# EAGLE design schema (EAGLE 8.7.0)
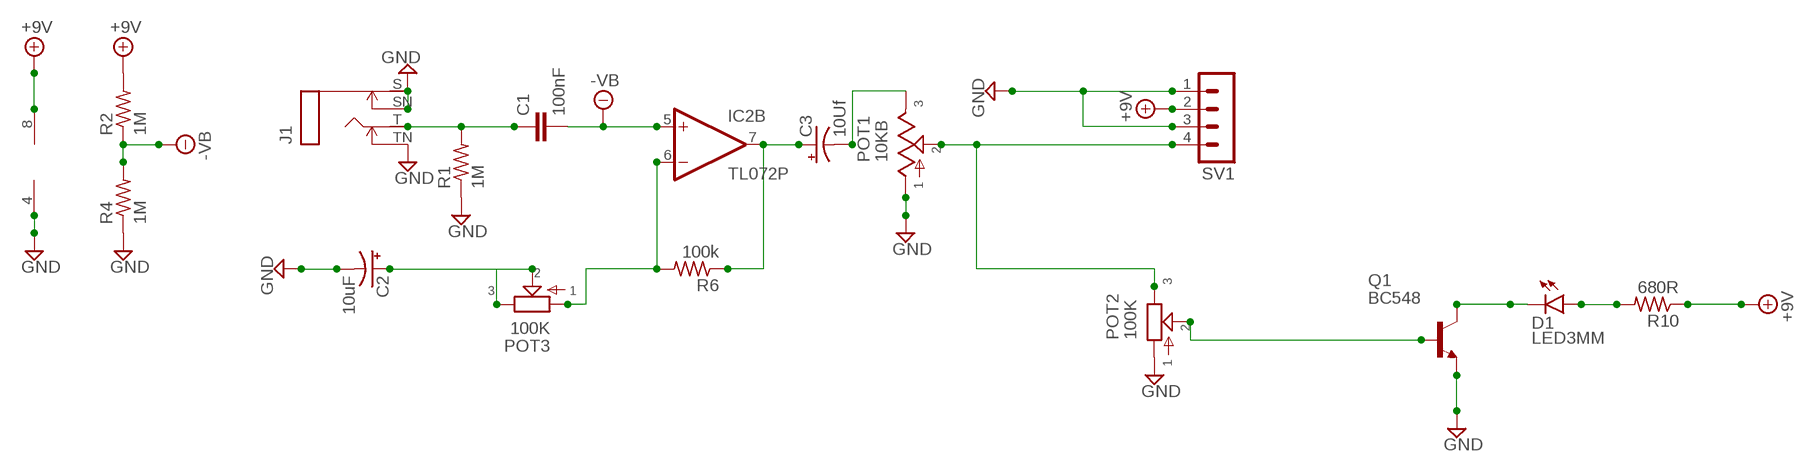
[diagram p0: schematic, sheet 1]

## Parts
C1  100nF  072X0352  [072X035]
C2  10uF  0501  [050_020_1]
C3  10Uf  0501  [050_020_1]
D1  LED3MM  [LED3MM]
IC2  TL072P  [DIL08]
J1  MONOSWS  [NMJ4HC-S]
POT1  10KB  POTPCB  [16MM-PCB-MOUNT]
POT2  100K  POT-EU25  [B25P]
POT3  100K  POT-EU25  [B25P]
Q1  BC548  [TO92-EBC]
R1  1M  6MM.3  [R0207/3]
R2  1M  6MM.3  [R0207/3]
R4  1M  6MM.3  [R0207/3]
R6  100k  6MM.1  [R0207/1V]
R10  680R  6MM.3  [R0207/3]
SV1  MA04-1  [MA04-1]

## Nets
+9V: IC2.8(P:V+) R2.2 R10.1 SV1.2
-VB: C1.2 IC2.5(B:+IN) R2.1 R4.2
GND: C2.- IC2.4(P:V-) J1.S J1.SN J1.TN POT1.1 POT2.1 Q1.E R1.1 R4.1 SV1.1 SV1.3
N$1: C1.1 J1.T R1.2
N$2: IC2.6(B:-IN) POT3.1 R6.2
N$3: C3.- POT1.3
N$4: D1.A R10.2
N$6: C2.+ POT3.2 POT3.3
N$7: D1.K(C) Q1.C
N$8: C3.+ IC2.7(B:OUT) R6.1
N$9: POT1.2 POT2.3 SV1.4
N$10: POT2.2 Q1.B
Unconnected: IC2.1(A:OUT) IC2.2(A:-IN) IC2.3(A:+IN)

## Library data of the parts
C1 = mb_caps-box:072X035: 0.15 - 1.0uF; WIMA MKP2 63, 100V: 0.047uF; MKS2 50V: 0.68 - 1.0uF; 63V: 0.33 - 0.47uF; 100V: 0.15 - 0.22uF;
C2 C3 = mb_caps-electro:050: 0.22 - 100uF Xicon values at Mouser.com: 10V: 10 - 100uF; 16V: 2.2 - 47uF; 25V: 0.47 - 47uF; 50V: 0.22 - 22uF
D1 = mb_diodes:LED
IC2 = mb_ics:TL072: OP AMP
J1 = mb_jacks:MONOSW
POT1 = mb_pots:POT: Potentiometers the arrow indicates the clockwise motion of th wiper (lug 2) fully counter clockwise there is no resistance between lugs 1 and 2 fully clockwise the resistance between lugs 1 and 2 is the value of the pot
POT2 POT3 = mb_pots:POT-EU
Q1 = transistor-npn:BC548*: NPN Transistor
R1 R2 R4 R6 R10 = mb_resistors:6MM: 6mm Resistors Leads spaced 1-6 holes apart for 0.1" perfboard. Suitable for 1/4 watt resistors.
SV1 = con-lstb:MA04-1: PIN HEADER; OC_FARNELL: unknown; OC_NEWARK: unknown

## Board
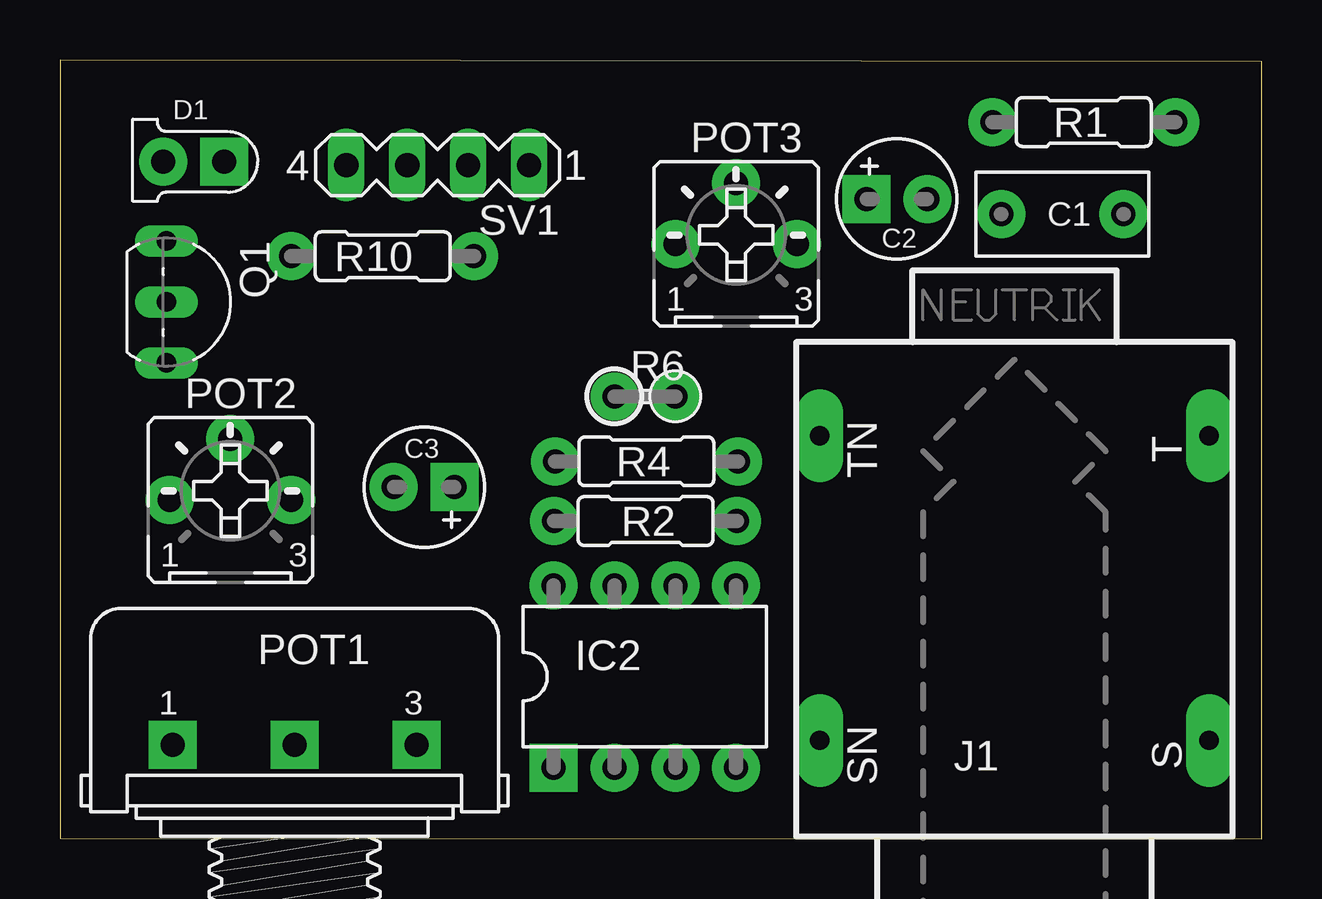
[diagram p1: board, top side]
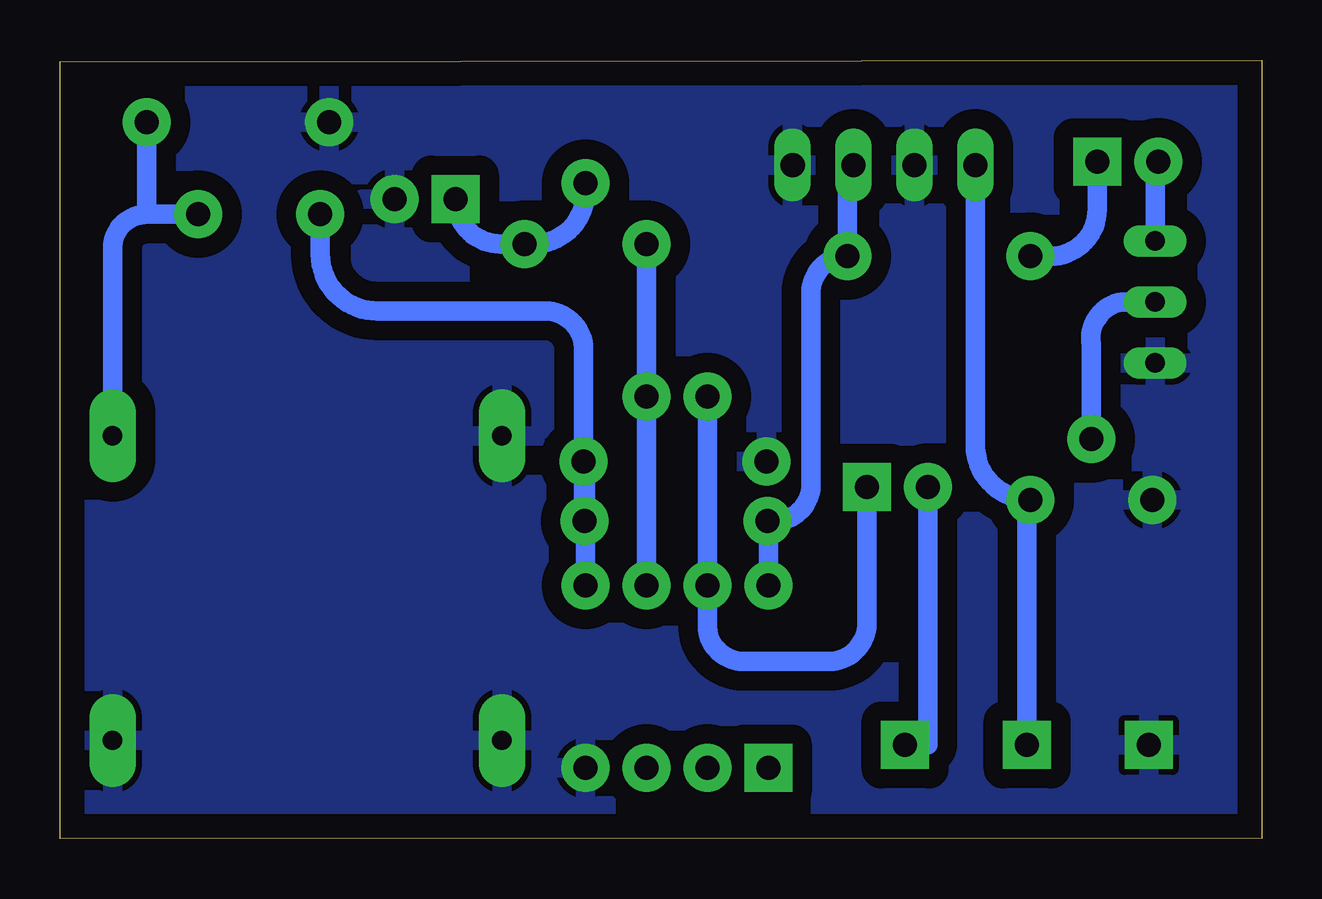
[diagram p2: board, bottom side, seen from below]

Size 50.09 x 32.46 mm. Coordinates in mm from the lower left corner, seen from the top.
Outline: 0,0.02 50.09,0 50.08,32.38 0,32.46 0,0.02
Copper layers (1*16): Top 0.035mm / dielectric 1.5mm / Bottom 0.035mm
Design rules "default": minimum track width 10mil, minimum drill 24mil, track to track 8mil, track to pad 8mil, pad to pad 8mil, via to via 8mil, smd to smd 8mil, copper to edge 40mil, drill to drill 8mil, minimum pad ring 10mil, minimum via ring 8mil, stop-mask expansion 4mil, vias tented up to drill 0mil, thermal gap 10mil

### Footprints (pad centres in the part's own frame; a part is rotated, then mirrored left to right if it is on the bottom)
072X035 = drill 1 pad 2: 1 -2.54,0; 2 2.54,0
050_020_1 = drill 1 pad 2 square: + -1.27,0 | drill 1 pad 2: - 1.27,0
LED3MM = drill 1 pad 2 square: A -1.27,0 | drill 1 pad 2: K 1.27,0
DIL08 = drill 1 pad 2 square: 1 -3.81,-3.81 | drill 1 pad 2: 2 -1.27,-3.81; 3 1.27,-3.81; 4 3.81,-3.81; 5 3.81,3.81; 6 1.27,3.81; 7 -1.27,3.81; 8 -3.81,3.81
NMJ4HC-S = drill 0.8 pad 1.93 long: S 5.08,8.115; SN 5.08,-8.115; T -7.62,8.115; TN -7.62,-8.115
16MM-PCB-MOUNT = drill 1 pad 2 square: 1 5.08,0; 2 0,0; 3 -5.08,0
B25P = drill 1 pad 2: 1 -2.54,0; 2 0,2.54; 3 2.54,0
TO92-EBC = drill 0.813 long: B 0,-1.27; C -2.54,-1.27; E 2.54,-1.27
R0207/3 = drill 1 pad 2: 1 -3.81,0; 2 3.81,0
R0207/1V = drill 1 pad 2: 1 -1.27,0; 2 1.27,0
MA04-1 = drill 1.016 long: 1 -3.81,0; 2 -1.27,0; 3 1.27,0; 4 3.81,0

### Placement (x,y rotation side)
C1  41.78,26.03 180 top
C2  34.88,26.67 0 top
C3  15.19,14.65 180 top
D1  5.58,28.22 180 top
IC2  24.38,6.75 0 top
J1  39.78,9.17 270 top
POT1  9.78,3.91 180 top
POT2  7.1,14.12 0 top
POT3  28.19,24.79 0 top
Q1  5.71,22.38 270 top
R1  42.67,29.87 0 top
R2  24.41,13.24 180 top
R4  24.44,15.73 0 top
R6  24.38,18.44 0 top
R10  13.45,24.28 180 top
SV1  15.74,28.08 180 top

### Tracks (layer width: path | path; a pad name or v marks a point on that pad's centre or on a via)
+9V
  Bottom 0.813: IC2.8 20.57,13.24 R2.2 20.28,13.24 arc-90 18.79,14.73 18.79,22.76 arc90 R10.1 17.26,28.08 SV1.2
-VB
  Bottom 0.813: 28.19,10.53 IC2.5 28.19,15.73 R4.2 | R4.2 28.25,13.24 R2.1 | R4.2 28.25,20.39 arc-90 29.86,21.99 36.85,21.99 arc90 39.24,24.38 C1.2
GND
  pour Bottom (isolate 0.813): -2.4,34.43 52.12,34.52 51.97,-2.03 -2.38,-1.77
N$1
  Bottom 0.813: C1.1 46.48,26.03 | 46.48,26.03 arc-90 47.9,24.61 J1.T | R1.2 46.48,26.03
N$2
  Bottom 0.813: IC2.6 R6.2 POT3.1
N$3
  Bottom 0.813: 14.3,3.91 POT1.3 13.91,3.91 C3.-
N$4
  Bottom 0.813: D1.A 6.85,26.23 arc90 8.8,24.28 R10.2
N$6
  Bottom 0.813: POT3.2 28.19,26.96 arc90 30.35,24.79 POT3.3 31.73,24.79 arc90 C2.+
N$7
  Bottom 0.813: Q1.C 4.44,28.22 D1.K
N$8
  Bottom 0.813: R6.1 IC2.7 23.11,8.9 arc-90 21.59,7.39 18.04,7.39 arc-90 16.45,8.97 C3.+
N$9
  Bottom 0.813: POT1.2 9.78,14.12 POT2.3 arc90 11.93,16.41 SV1.4
N$10
  Bottom 0.813: Q1.B 5.83,22.38 arc-90 7.1,20.6 POT2.2